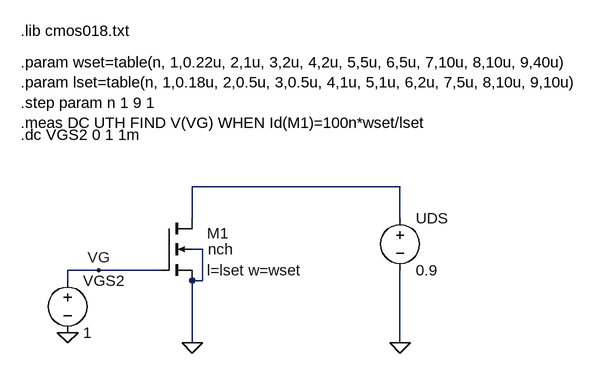
[diagram p0: schematic Draft2N.asc]
Draft2N.asc, the LTspice schematic file:
Version 4
SHEET 1 1356 680
WIRE 544 176 224 176
WIRE 224 224 224 176
WIRE 544 224 544 176
WIRE 240 272 224 272
WIRE 80 304 32 304
WIRE 176 304 80 304
WIRE 32 320 32 304
WIRE 240 320 240 272
WIRE 240 320 224 320
WIRE 224 416 224 320
WIRE 544 416 544 304
FLAG 224 416 0
FLAG 544 416 0
FLAG 80 304 VG
FLAG 32 400 0
SYMBOL voltage 32 304 R0
WINDOW 123 0 0 Left 0
WINDOW 39 0 0 Left 0
SYMATTR InstName VGS2
SYMATTR Value 1
SYMBOL voltage 544 208 R0
WINDOW 123 0 0 Left 0
WINDOW 39 0 0 Left 0
SYMATTR InstName UDS
SYMATTR Value 0.9
SYMBOL nmos4 176 224 R0
WINDOW 0 71 23 Left 2
WINDOW 3 72 48 Left 2
WINDOW 123 71 80 Left 2
SYMATTR InstName M1
SYMATTR Value nch
SYMATTR Value2 l=lset w=wset
TEXT -40 -64 Left 2 !.lib cmos018.txt
TEXT -40 96 Left 2 !.dc VGS2 0 1 1m
TEXT -40 -16 Left 2 !.param wset=table(n, 1,0.22u, 2,1u, 3,2u, 4,2u, 5,5u, 6,5u, 7,10u, 8,10u, 9,40u)\n.param lset=table(n, 1,0.18u, 2,0.5u, 3,0.5u, 4,1u, 5,1u, 6,2u, 7,5u, 8,10u, 9,10u)\n.step param n 1 9 1\n.meas DC UTH FIND V(VG) WHEN Id(M1)=100n*wset/lset

The netlist it stands for:
* Draft2N.asc
VGS2 VG 0 1
V§UDS N001 0 0.9
M1 N001 VG 0 0 nch l=lset w=wset
.model NMOS NMOS
.model PMOS PMOS
.lib standard.mos
.lib cmos018.txt
.dc VGS2 0 1 1m
.param wset=table(n, 1,0.22u, 2,1u, 3,2u, 4,2u, 5,5u, 6,5u, 7,10u, 8,10u, 9,40u)
.param lset=table(n, 1,0.18u, 2,0.5u, 3,0.5u, 4,1u, 5,1u, 6,2u, 7,5u, 8,10u, 9,10u)
.step param n 1 9 1
.meas DC UTH FIND V(VG) WHEN Id(M1)=100n*wset/lset
.backanno
.end